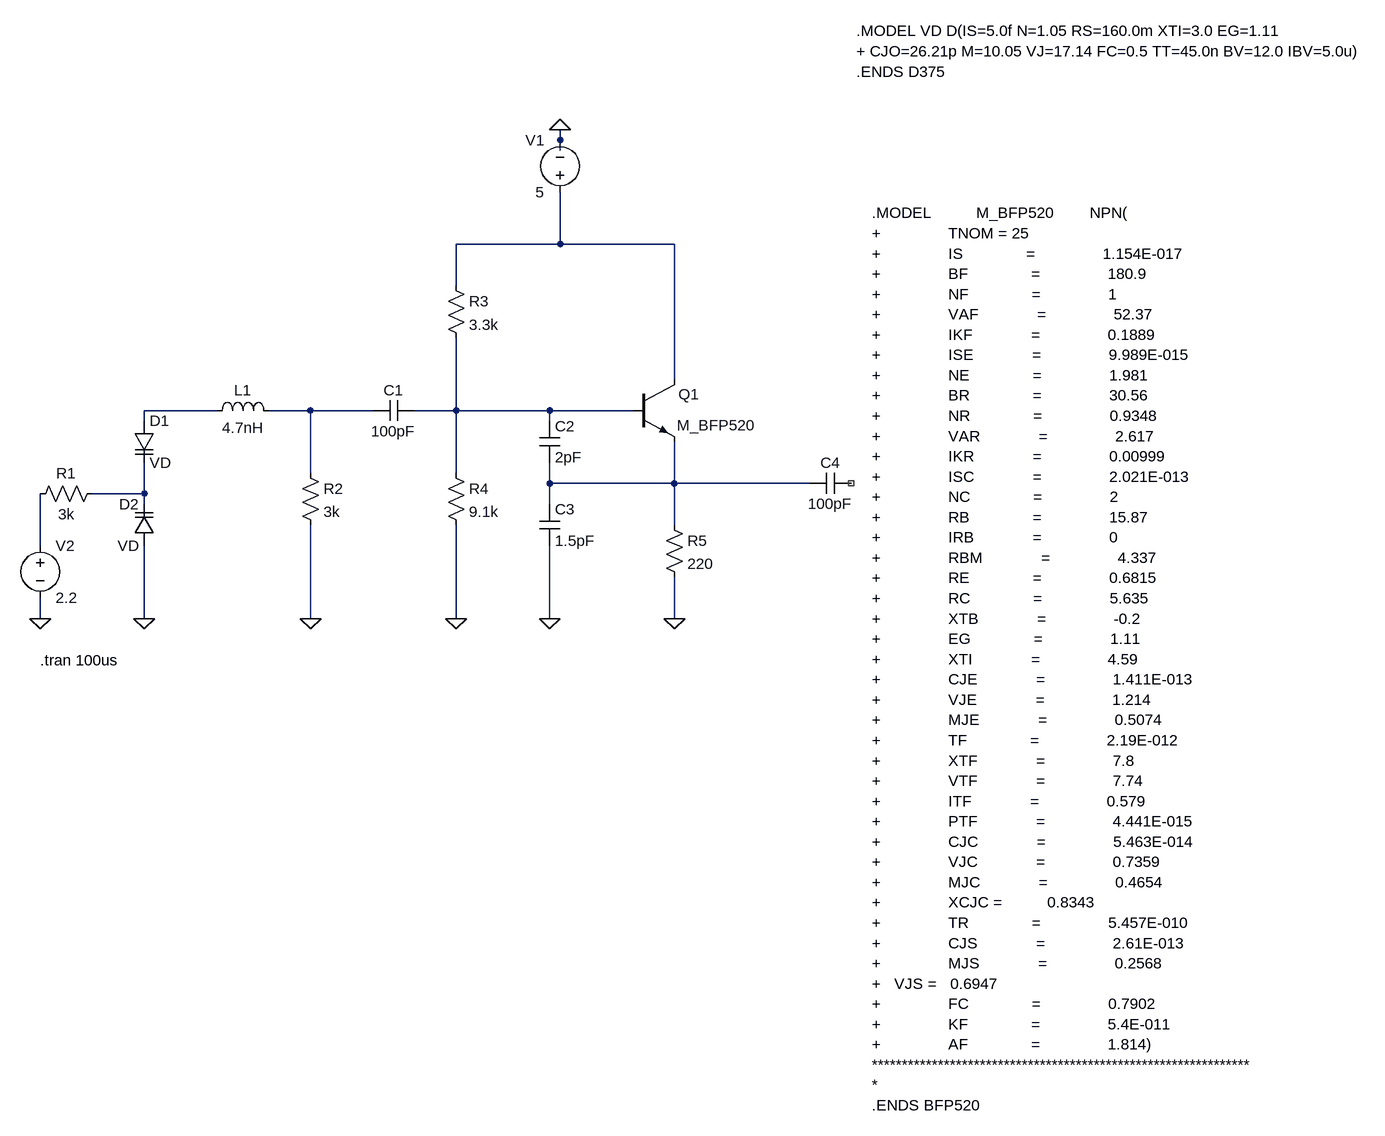
[diagram p0: schematic vco twg fin.asc]
vco twg fin.asc, the LTspice schematic file:
Version 4
SHEET 1 2716 888
WIRE 1312 -528 1312 -544
WIRE 1312 -512 1312 -528
WIRE 1312 -368 1312 -448
WIRE 1312 -368 1152 -368
WIRE 1488 -368 1312 -368
WIRE 1152 -304 1152 -368
WIRE 1488 -160 1488 -368
WIRE 784 -112 672 -112
WIRE 928 -112 864 -112
WIRE 1024 -112 928 -112
WIRE 1152 -112 1152 -224
WIRE 1152 -112 1088 -112
WIRE 1296 -112 1152 -112
WIRE 1424 -112 1296 -112
WIRE 672 -96 672 -112
WIRE 1296 -96 1296 -112
WIRE 928 -16 928 -112
WIRE 1152 -16 1152 -112
WIRE 1296 0 1296 -32
WIRE 1488 0 1488 -64
WIRE 1488 0 1296 0
WIRE 1696 0 1488 0
WIRE 672 16 672 -32
WIRE 672 16 592 16
WIRE 672 32 672 16
WIRE 1296 32 1296 0
WIRE 1488 64 1488 0
WIRE 512 96 512 16
WIRE 512 208 512 176
WIRE 672 208 672 96
WIRE 928 208 928 64
WIRE 1152 208 1152 64
WIRE 1296 208 1296 96
WIRE 1488 208 1488 144
FLAG 1312 -544 0
FLAG 512 208 0
FLAG 1152 208 0
FLAG 1296 208 0
FLAG 1488 208 0
FLAG 928 208 0
FLAG 672 208 0
SYMBOL res 608 0 R90
WINDOW 0 0 56 VBottom 2
WINDOW 3 32 56 VTop 2
SYMATTR InstName R1
SYMATTR Value 3k
SYMBOL res 912 -32 R0
SYMATTR InstName R2
SYMATTR Value 3k
SYMBOL res 1136 -320 R0
SYMATTR InstName R3
SYMATTR Value 3.3k
SYMBOL res 1136 -32 R0
SYMATTR InstName R4
SYMATTR Value 9.1k
SYMBOL res 1472 48 R0
SYMATTR InstName R5
SYMATTR Value 220
SYMBOL cap 1088 -128 R90
WINDOW 0 0 32 VBottom 2
WINDOW 3 32 32 VTop 2
SYMATTR InstName C1
SYMATTR Value 100pF
SYMBOL cap 1280 -96 R0
SYMATTR InstName C2
SYMATTR Value 2pF
SYMBOL cap 1280 32 R0
SYMATTR InstName C3
SYMATTR Value 1.5pF
SYMBOL cap 1760 -16 R90
WINDOW 0 0 32 VBottom 2
WINDOW 3 32 32 VTop 2
SYMATTR InstName C4
SYMATTR Value 100pF
SYMBOL ind 768 -96 R270
WINDOW 0 32 56 VTop 2
WINDOW 3 5 56 VBottom 2
SYMATTR InstName L1
SYMATTR Value 4.7nH
SYMBOL npn 1424 -160 R0
WINDOW 0 70 23 Left 2
WINDOW 3 68 71 Left 2
SYMATTR InstName Q1
SYMATTR Value M_BFP520
SYMBOL voltage 1312 -432 R180
WINDOW 0 24 96 Left 2
WINDOW 3 24 16 Left 2
WINDOW 123 0 0 Left 0
WINDOW 39 0 0 Left 0
SYMATTR InstName V1
SYMATTR Value 5
SYMBOL voltage 512 80 R0
WINDOW 123 0 0 Left 0
WINDOW 39 0 0 Left 0
SYMATTR InstName V2
SYMATTR Value 2.2
SYMBOL varactor 656 -96 R0
SYMATTR InstName D1
SYMATTR Value VD
SYMBOL varactor 688 96 R180
WINDOW 0 24 64 Left 2
WINDOW 3 24 0 Left 2
SYMATTR InstName D2
SYMATTR Value VD
TEXT 1792 -416 Left 2 !.MODEL          M_BFP520        NPN(\n+               TNOM = 25\n+               IS              =               1.154E-017\n+               BF              =               180.9\n+               NF              =               1\n+               VAF             =               52.37\n+               IKF             =               0.1889\n+               ISE             =               9.989E-015\n+               NE              =               1.981\n+               BR              =               30.56\n+               NR              =               0.9348\n+               VAR             =               2.617\n+               IKR             =               0.00999\n+               ISC             =               2.021E-013\n+               NC              =               2\n+               RB              =               15.87\n+               IRB             =               0\n+               RBM             =               4.337\n+               RE              =               0.6815\n+               RC              =               5.635\n+               XTB             =               -0.2\n+               EG              =               1.11\n+               XTI             =               4.59\n+               CJE             =               1.411E-013\n+               VJE             =               1.214\n+               MJE             =               0.5074\n+               TF              =               2.19E-012\n+               XTF             =               7.8\n+               VTF             =               7.74\n+               ITF             =               0.579\n+               PTF             =               4.441E-015\n+               CJC             =               5.463E-014\n+               VJC             =               0.7359\n+               MJC             =               0.4654\n+               XCJC =          0.8343\n+               TR              =               5.457E-010\n+               CJS             =               2.61E-013\n+               MJS             =               0.2568\n+   VJS =   0.6947\n+               FC              =               0.7902\n+               KF              =               5.4E-011\n+               AF              =               1.814)\n***************************************************************\n*\n.ENDS BFP520
TEXT 1768 -696 Left 2 !.MODEL VD D(IS=5.0f N=1.05 RS=160.0m XTI=3.0 EG=1.11\n+ CJO=26.21p M=10.05 VJ=17.14 FC=0.5 TT=45.0n BV=12.0 IBV=5.0u)\n.ENDS D375
TEXT 512 272 Left 2 !.tran 100us

The netlist it stands for:
* vco twg fin.asc
R1 N006 N007 3k
R2 N003 0 3k
R3 N001 N004 3.3k
R4 N004 0 9.1k
R5 N005 0 220
C1 N004 N003 100pF
C2 N004 N005 2pF
C3 N005 0 1.5pF
C4 NC_01 N005 100pF
L1 N002 N003 4.7nH
Q1 N001 N004 N005 0 M_BFP520
V1 N001 0 5
V2 N007 0 2.2
D1 N002 N006 VD
D2 0 N006 VD
.model D D
.lib standard.dio
.model NPN NPN
.model PNP PNP
.lib standard.bjt
.MODEL          M_BFP520        NPN(
+               TNOM = 25
+               IS              =               1.154E-017
+               BF              =               180.9
+               NF              =               1
+               VAF             =               52.37
+               IKF             =               0.1889
+               ISE             =               9.989E-015
+               NE              =               1.981
+               BR              =               30.56
+               NR              =               0.9348
+               VAR             =               2.617
+               IKR             =               0.00999
+               ISC             =               2.021E-013
+               NC              =               2
+               RB              =               15.87
+               IRB             =               0
+               RBM             =               4.337
+               RE              =               0.6815
+               RC              =               5.635
+               XTB             =               -0.2
+               EG              =               1.11
+               XTI             =               4.59
+               CJE             =               1.411E-013
+               VJE             =               1.214
+               MJE             =               0.5074
+               TF              =               2.19E-012
+               XTF             =               7.8
+               VTF             =               7.74
+               ITF             =               0.579
+               PTF             =               4.441E-015
+               CJC             =               5.463E-014
+               VJC             =               0.7359
+               MJC             =               0.4654
+               XCJC =          0.8343
+               TR              =               5.457E-010
+               CJS             =               2.61E-013
+               MJS             =               0.2568
+   VJS =   0.6947
+               FC              =               0.7902
+               KF              =               5.4E-011
+               AF              =               1.814)
***************************************************************
*
.ENDS BFP520
.MODEL VD D(IS=5.0f N=1.05 RS=160.0m XTI=3.0 EG=1.11
+ CJO=26.21p M=10.05 VJ=17.14 FC=0.5 TT=45.0n BV=12.0 IBV=5.0u)
.ENDS D375
.tran 100us
.backanno
.end